# EAGLE design LIS331_Accelerometer (EAGLE 7.4.0)
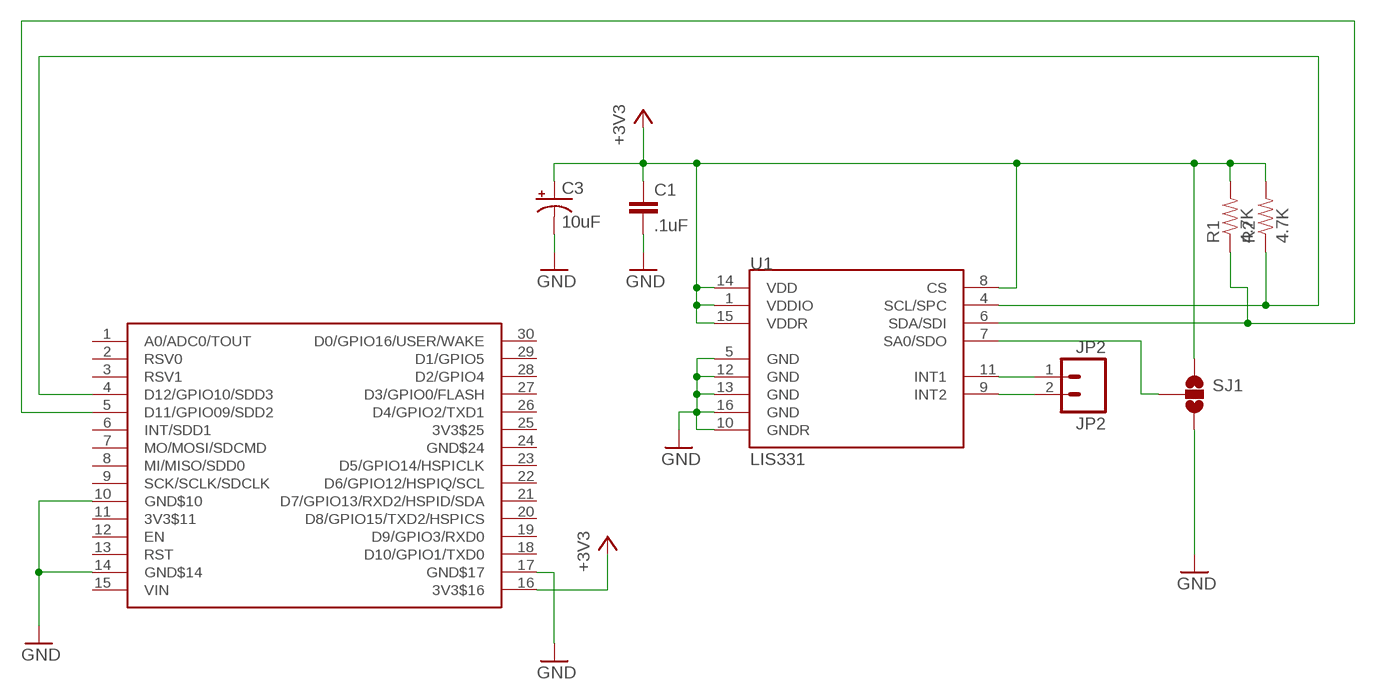
[diagram p0: schematic, sheet 1]

## Parts
C1  .1uF  CAP0603-CAP  [0603-CAP]
C3  10uF  CAP_POL1206  [EIA3216]
JP2  JP2  M02PTH  [1X02]
R1  4.7K  RESISTOR0603-RES  [0603-RES]
R2  4.7K  RESISTOR0603-RES  [0603-RES]
SJ1  SOLDERJUMPER_2WAYT  [SJ_2]
U1  LIS331  [LGA16-3MM]
U$2  NERDSHIELD  [NERDUINO_STACK]

## Nets
+3V3: C1.1 C3.A(+) R1.2 R2.2 SJ1.1 U1.1(VDDIO) U1.8(CS) U1.14(VDD) U1.15(VDDR) U$2.16(3V3$16)
GND: C1.2 C3.C(-) SJ1.3 U1.5(GND) U1.10(GNDR) U1.12(GND) U1.13(GND) U1.16(GND) U$2.10(GND$10) U$2.14(GND$14) U$2.17(GND$17)
N$2: R1.1 U1.6(SDA/SDI) U$2.5(D11/GPIO09/SDD2)
N$5: R2.1 U1.4(SCL/SPC) U$2.4(D12/GPIO10/SDD3)
N$6: SJ1.2 U1.7(SA0/SDO)
N$7: JP2.1 U1.11(INT1)
N$8: JP2.2 U1.9(INT2)
Unconnected: U$2.1(A0/ADC0/TOUT) U$2.2(RSV0) U$2.3(RSV1) U$2.6(INT/SDD1) U$2.7(MO/MOSI/SDCMD) U$2.8(MI/MISO/SDD0) U$2.9(SCK/SCLK/SDCLK) U$2.11(3V3$11) U$2.12(EN) U$2.13(RST) U$2.15(VIN) U$2.18(D10/GPIO1/TXD0) U$2.19(D9/GPIO3/RXD0) U$2.20(D8/GPIO15/TXD2/HSPICS) U$2.21(D7/GPIO13/RXD2/HSPID/SDA) U$2.22(D6/GPIO12/HSPIQ/SCL) U$2.23(D5/GPIO14/HSPICLK) U$2.24(GND$24) U$2.25(3V3$25) U$2.26(D4/GPIO2/TXD1) U$2.27(D3/GPIO0/FLASH) U$2.28(D2/GPIO4) U$2.29(D1/GPIO5) U$2.30(D0/GPIO16/USER/WAKE)

## Library data of the parts
C1 = SparkFun:CAP: Capacitor Standard 0603 ceramic capacitor, and 0.1" leaded capacitor.
C3 = SparkFun:CAP_POL: Capacitor Polarized These are standard SMD and PTH capacitors. Normally 10uF, 47uF, and 100uF in electrolytic and tantalum varieties. Always verify the external diameter of the through hole cap, it varies with capacity, voltage, and manufacturer. The EIA devices should be standard.
JP2 = SparkFun:M02: Header 2 Standard 2-pin 0.1" header. Use with straight break away headers (SKU : PRT-00116), right angle break away headers (PRT-00553), swiss pins (PRT-00743), machine pins (PRT-00117), and female headers (PRT-00115). Molex polarized connector foot print use with SKU : PRT-08233 with associated crimp pins and housings.
R1 R2 = SparkFun:RESISTOR: Resistor Basic schematic elements and footprints for 0603, 1206, and PTH resistors.
SJ1 = SparkFun:SOLDERJUMPER_2WAY: Solder Jumper 2 way solder jumper
U1 = SparkFun:LIS331: LIS331HH 3-axis accelerometer
U$2 = NerduinoShieldLib:NERDSHIELD

## Board
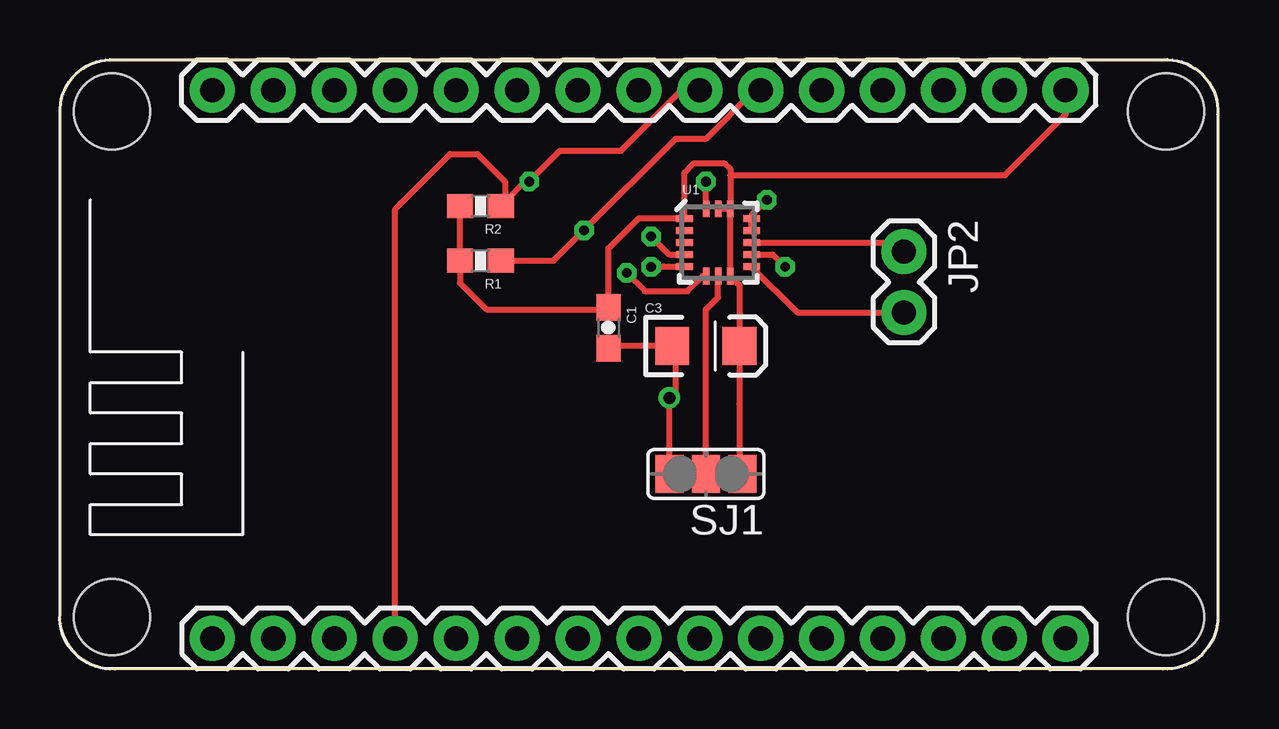
[diagram p1: board, top side]
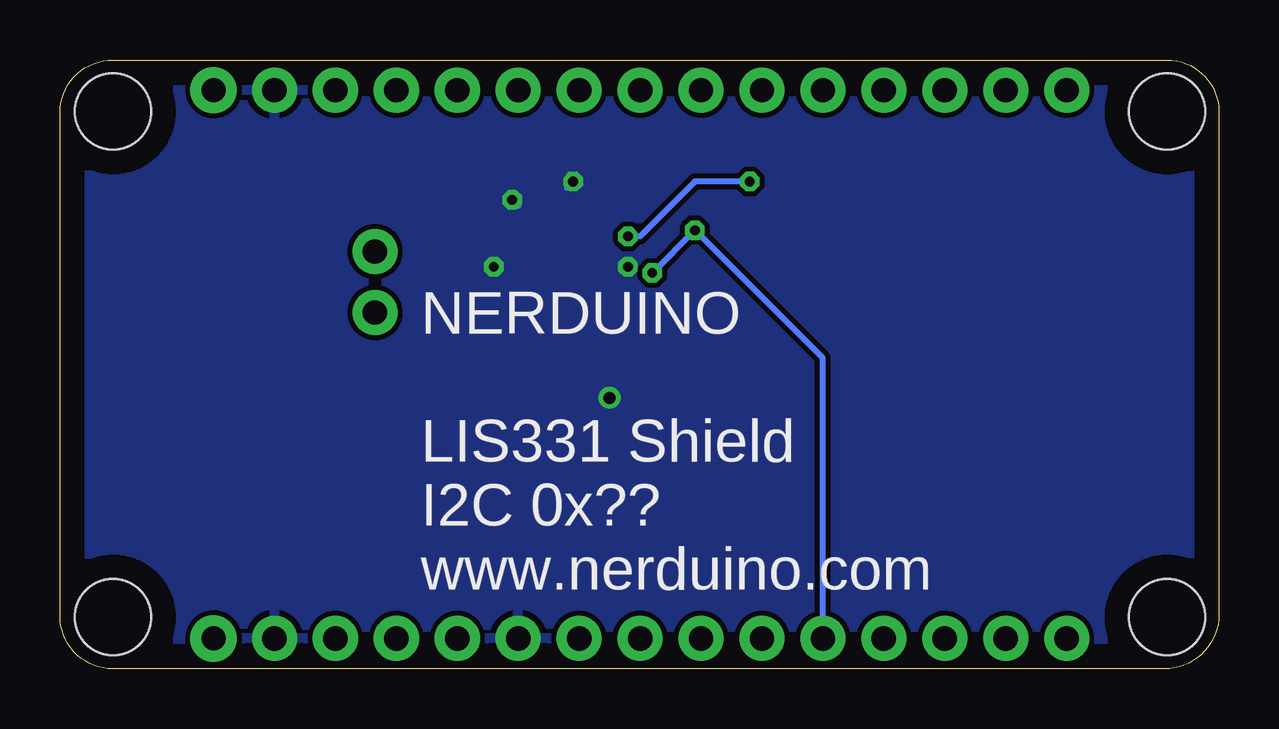
[diagram p2: board, bottom side, seen from below]

Size 48.31 x 25.39 mm. Coordinates in mm from the lower left corner, seen from the top.
Outline: 48.31,2.2 48.31,23.19 arc90 46.11,25.39 2.17,25.39 arc90 0,23.22 0,2.29 arc90 2.29,0 46.11,0 arc90 48.31,2.2
Copper layers (1*16): Top 0.035mm / dielectric 1.5mm / Bottom 0.035mm
Design rules "default": minimum track width 10mil, minimum drill 24mil, track to track 8mil, track to pad 8mil, pad to pad 8mil, via to via 8mil, smd to smd 8mil, copper to edge 40mil, drill to drill 8mil, minimum pad ring 10mil, minimum via ring 8mil, stop-mask expansion 4mil, vias tented up to drill 0mil, thermal gap 10mil

### Footprints (pad centres in the part's own frame; a part is rotated, then mirrored left to right if it is on the bottom)
0603-CAP = smd 1.1 x 1: 1 -0.85,0; 2 0.85,0
EIA3216 = smd 1.4 x 1.6: A 1.4,0; C -1.4,0
1X02 = drill 1.016 pad 1.88: 1 0,0; 2 2.54,0
0603-RES = smd 1.1 x 1: 1 -0.85,0; 2 0.85,0
SJ_2 = smd 1.168 x 1.6: 1 -1.524,0; 2 0,0; 3 1.524,0
LGA16-3MM = smd 0.7 x 0.28: 1 -1.4,1; 2 -1.4,0.5; 3 -1.4,0; 4 -1.4,-0.5; 5 -1.4,-1; 9 1.4,-1; 10 1.4,-0.5; 11 1.4,0; 12 1.4,0.5; 13 1.4,1 | smd 0.28 x 0.7: 6 -0.5,-1.4; 7 0,-1.4; 8 0.5,-1.4; 14 0.5,1.4; 15 0,1.4; 16 -0.5,1.4
NERDUINO_STACK = drill 1.016 pad 1.88: 1 -17.78,-5.08; 2 -15.24,-5.08; 3 -12.7,-5.08; 4 -10.16,-5.08; 5 -7.62,-5.08; 6 -5.08,-5.08; 7 -2.54,-5.08; 8 0,-5.08; 9 2.54,-5.08; 10 5.08,-5.08; 11 7.62,-5.08; 12 10.16,-5.08; 13 12.7,-5.08; 14 15.24,-5.08; 17 15.24,17.78; 18 12.7,17.78; 19 10.16,17.78; 20 7.62,17.78; 21 5.08,17.78; 22 2.54,17.78; 23 0,17.78; 24 -2.54,17.78; 25 -5.08,17.78; 26 -7.62,17.78; 27 -10.16,17.78; 28 -12.7,17.78; 29 -15.24,17.78; 30 -17.78,17.78 | drill 1 pad 1.93: 15 17.78,-5.08; 16 17.78,17.78 | hole 3.175: -21.971,16.891; -21.971,-4.191; 21.971,-4.191; 21.971,16.891

### Placement (x,y rotation side)
C1  22.86,14.22 270 top
C3  26.92,13.46 0 top
JP2  35.18,17.4 270 top
R1  17.53,17.02 180 top
R2  17.53,19.3 180 top
SJ1  26.92,8.13 180 top
U1  27.43,17.78 0 top
U$2  24.13,6.35 0 top

### Tracks (layer width: path | path; a pad name or v marks a point on that pad's centre or on a via)
+3V3
  Top 0.254: 16.76,19.39 R2.2 R1.2 16.68,16.09 17.78,14.99 22.77,14.99 C1.1 22.86,17.53 24.13,18.8 26.02,18.8 U1.1 26.03,20.7 26.42,21.08 27.69,21.08 27.94,20.83 27.94,20.57 | U1.14 U1.8 28.32,15.99 C3.A 28.32,11.05 28.32,8.76 28.45,8.76 SJ1.1 | U1.14 U1.15 | 27.94,20.57 27.94,19.19 U1.14 | U$2.16 41.91,23.11 39.37,20.57 27.94,20.57
GND  (via drill 0.41 pad 0.41, 0.5)
  Top 0.254: C1.2 22.95,13.46 C3.C 25.65,12.83 25.65,11.56 v25.4,11.3 SJ1.3 | U1.12 U1.13 28.83,18.93 v29.46,19.56 | U1.10 29.71,17.28 v30.23,16.76 | U1.16 26.93,20.06 v26.92,20.32 | U1.5 25.16,16.78 v24.64,16.76
  Bottom 0.254: v29.46,19.56 29.21,19.3 | v30.23,16.76 30.23,17.02 | v26.92,20.32 27.18,20.07 | v25.4,11.3 25.27,11.3
  pour Bottom: 0.13,25.27 48.26,25.27 48.13,0 0,0
N$2  (via drill 0.41 pad 0.41)
  Top 0.254: v21.84,18.29 20.57,17.02 R1.1 | U1.6 26.79,16.38 26.16,15.75 24.38,15.75 v23.62,16.51 | v21.84,18.29 22.1,18.54 | 28.96,24.13 26.92,22.1 25.65,22.1 v21.84,18.29
  Bottom 0.254: v23.62,16.51 v21.84,18.29 16.51,12.95 U$2.5
N$5  (via drill 0.41 pad 0.41)
  Top 0.254: 18.29,19.39 R2.1 18.59,19.51 | U1.4 25.39,17.28 v24.64,18.03 | 18.59,19.51 19.39,20.32 v19.56,20.32 20.83,21.59 23.37,21.59 25.91,24.13 | U$2.4 13.97,19.18 16.26,21.46 17.4,21.46 18.54,20.32 18.54,19.56 18.59,19.51
  Bottom 0.254: v24.64,18.03 24.13,18.03 21.84,20.32 v19.56,20.32
N$6
  Top 0.254: SJ1.2 26.92,14.99 27.43,15.49 U1.7
N$7
  Top 0.254: U1.11 34.8,17.78 JP2.1
N$8
  Top 0.254: U1.9 28.83,16.76 30.73,14.86 JP2.2

### Text on the board
_bsilk: NERDUINO / / LIS331 Shield / I2C 0x?? / www.nerduino.com